# EAGLE design LED_Driver (EAGLE 8.0.0)
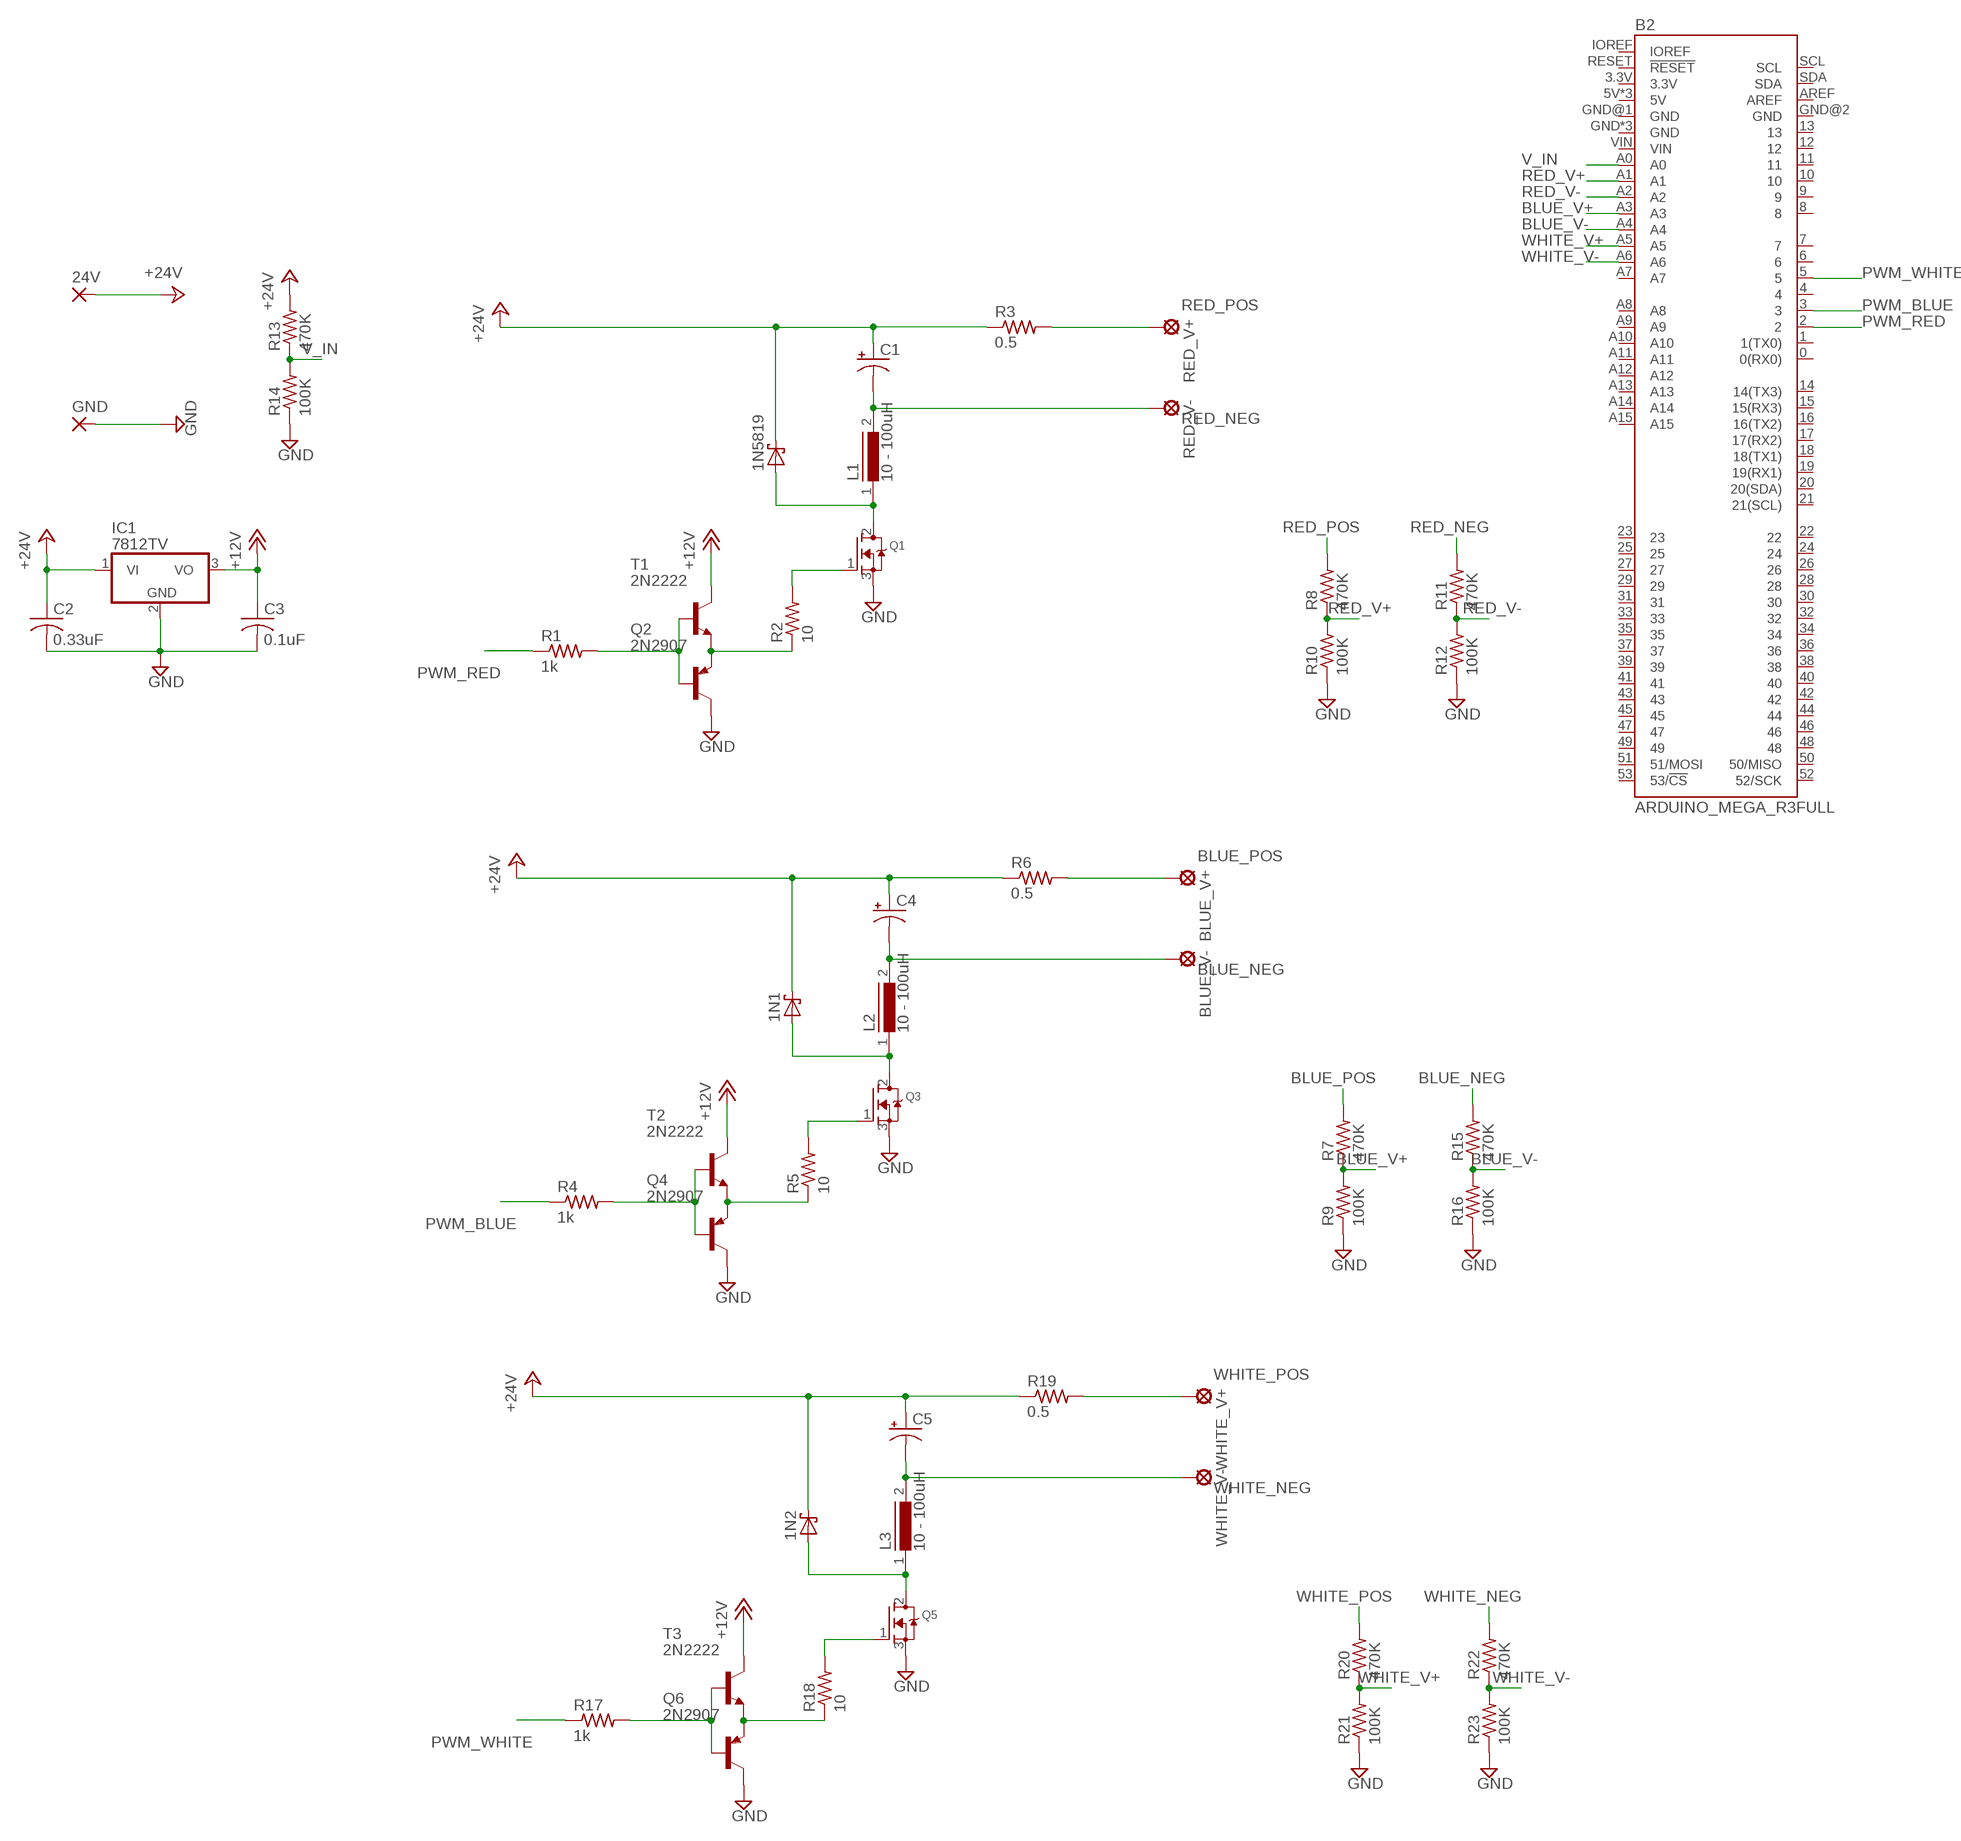
[diagram p0: schematic, sheet 1]

## Parts
1N1  SCHOTTKY-DIODEDO41  [DO41-10]
1N2  SCHOTTKY-DIODEDO41  [DO41-10]
1N5819  SCHOTTKY-DIODEDO41  [DO41-10]
24V  WIREPAD2,54/1,1  [2,54/1,1]
B2  ARDUINO_MEGA_R3FULL  [ARDUINO_MEGA_NO_SILK]
BLUE_V+  LSP13  [LSP13]
BLUE_V-  LSP13  [LSP13]
C1  CPOL-USE5-10.5  [E5-10,5]
C2  0.33uF  C-USC0805K  [C0805K]
C3  0.1uF  C-USC0805K  [C0805K]
C4  CPOL-USE5-10.5  [E5-10,5]
C5  CPOL-USE5-10.5  [E5-10,5]
GND  WIREPAD2,54/1,1  [2,54/1,1]
IC1  7812TV  [TO220V]
L1  10 - 100uH  SFT1030  [SFT1030]
L2  10 - 100uH  SFT1030  [SFT1030]
L3  10 - 100uH  SFT1030  [SFT1030]
Q1  MOSFET-NGDS_TO220V  [TO220V]
Q2  2N2907  [TO92-EBC-OVAL]
Q3  MOSFET-NGDS_TO220V  [TO220V]
Q4  2N2907  [TO92-EBC-OVAL]
Q5  MOSFET-NGDS_TO220V  [TO220V]
Q6  2N2907  [TO92-EBC-OVAL]
R1  1k  R-US_0207/7  [0207/7]
R2  10  R-US_0207/7  [0207/7]
R3  0.5  R-US_0207/7  [0207/7]
R4  1k  R-US_0207/7  [0207/7]
R5  10  R-US_0207/7  [0207/7]
R6  0.5  R-US_0207/7  [0207/7]
R7  470K  R-US_0207/7  [0207/7]
R8  470K  R-US_0207/7  [0207/7]
R9  100K  R-US_0207/7  [0207/7]
R10  100K  R-US_0207/7  [0207/7]
R11  470K  R-US_0207/7  [0207/7]
R12  100K  R-US_0207/7  [0207/7]
R13  470K  R-US_R0805  [R0805]
R14  100K  R-US_R0805  [R0805]
R15  470K  R-US_0207/7  [0207/7]
R16  100K  R-US_0207/7  [0207/7]
R17  1k  R-US_0207/7  [0207/7]
R18  10  R-US_0207/7  [0207/7]
R19  0.5  R-US_0207/7  [0207/7]
R20  470K  R-US_0207/7  [0207/7]
R21  100K  R-US_0207/7  [0207/7]
R22  470K  R-US_0207/7  [0207/7]
R23  100K  R-US_0207/7  [0207/7]
RED_V+  LSP13  [LSP13]
RED_V-  LSP13  [LSP13]
T1  2N2222  [TO92-EBC-OVAL]
T2  2N2222  [TO92-EBC-OVAL]
T3  2N2222  [TO92-EBC-OVAL]
WHITE_V+  LSP13  [LSP13]
WHITE_V-  LSP13  [LSP13]

## Nets
+12V: C3.1 IC1.3(VO) T1.C T2.C T3.C
+24V: 1N1.C 1N2.C 1N5819.C 24V.1(P) C1.+ C2.1 C4.+ C5.+ IC1.1(VI) R3.1 R6.1 R13.2 R19.1
BLUE_NEG: BLUE_V-.MP C4.- L2.2 R15.2
BLUE_POS: BLUE_V+.MP R6.2 R7.2
BLUE_V+: B2.A3 R7.1 R9.2
BLUE_V-: B2.A4 R15.1 R16.2
GND: C2.2 C3.2 GND.1(P) IC1.2(GND) Q1.3(S) Q2.C Q3.3(S) Q4.C Q5.3(S) Q6.C R9.1 R10.1 R12.1 R14.1 R16.1 R21.1 R23.1
N$1: Q2.E R2.1 T1.E
N$2: 1N5819.A L1.1 Q1.2(D)
N$3: Q4.E R5.1 T2.E
N$4: Q2.B R1.2 T1.B
N$5: Q1.1(G) R2.2
N$6: 1N1.A L2.1 Q3.2(D)
N$7: Q4.B R4.2 T2.B
N$8: Q3.1(G) R5.2
N$9: Q6.E R18.1 T3.E
N$10: 1N2.A L3.1 Q5.2(D)
N$11: Q6.B R17.2 T3.B
N$12: Q5.1(G) R18.2
PWM_BLUE: B2.3 R4.1
PWM_RED: B2.2 R1.1
PWM_WHITE: B2.5 R17.1
RED_NEG: C1.- L1.2 R11.2 RED_V-.MP
RED_POS: R3.2 R8.2 RED_V+.MP
RED_V+: B2.A1 R8.1 R10.2
RED_V-: B2.A2 R11.1 R12.2
V_IN: B2.A0 R13.1 R14.2
WHITE_NEG: C5.- L3.2 R22.2 WHITE_V-.MP
WHITE_POS: R19.2 R20.2 WHITE_V+.MP
WHITE_V+: B2.A5 R20.1 R21.2
WHITE_V-: B2.A6 R22.1 R23.2
Unconnected: B2.0(0(RX0)) B2.1(1(TX0)) B2.3.3V B2.4 B2.5V B2.5V@1(5V) B2.5V@2(5V) B2.6 B2.7 B2.8 B2.9 B2.10 B2.11 B2.12 B2.13 B2.14(14(TX3)) B2.15(15(RX3)) B2.16(16(TX2)) B2.17(17(RX2)) B2.18(18(TX1)) B2.19(19(RX1)) B2.20(20(SDA)) B2.21(21(SCL)) B2.22 B2.23 B2.24 B2.25 B2.26 B2.27 B2.28 B2.29 B2.30 B2.31 B2.32 B2.33 B2.34 B2.35 B2.36 B2.37 B2.38 B2.39 B2.40 B2.41 B2.42 B2.43 B2.44 B2.45 B2.46 B2.47 B2.48 B2.49 B2.50(50/MISO) B2.51(51/MOSI) B2.52(52/SCK) B2.53(53/!CS) B2.A7 B2.A8 B2.A9 B2.A10 B2.A11 B2.A12 B2.A13 B2.A14 B2.A15 B2.AREF B2.GND B2.GND@1(GND) B2.GND@2(GND) B2.GND@3(GND) B2.GND@4(GND) B2.IOREF B2.RESET(!RESET) B2.SCL B2.SDA B2.VIN

## Library data of the parts
1N1 1N2 1N5819 = adafruit:SCHOTTKY-DIODE: Schottky Diode
24V GND = wirepad:WIREPAD: Wire PAD connect wire on PCB
B2 = Sparkfun-Boards:ARDUINO_MEGA_R3: Arduino Mega R3 ATmega2560 R3 compatible footprint. SparkFun Products: Arduino Mega 2560 R3 <�https://www.sparkfun.com/products/11061�>
BLUE_V+ BLUE_V- RED_V+ RED_V- WHITE_V+ WHITE_V- = solpad:LSP13: SOLDER PAD drill 1.3 mm, distributor Buerklin, 12H562
C1 C4 C5 = adafruit:CPOL-US: POLARIZED CAPACITOR, American symbol
C2 C3 = adafruit:C-US: CAPACITOR, American symbol
IC1 = linear:78*: Positive VOLTAGE REGULATOR Source: http://cache.national.com/ds/LM/LM78L05.pdf http://www.fairchildsemi.com/ds/LM/LM7805.pdf
L1-L3 = inductors:SFT1030: INDUCTOR
Q1 Q3 Q5 = adafruit:MOSFET-N: N-Channel Mosfet 2N7002E - 60V 260mA SOT23 [Digikey: 2N7002ET1GOSTR-ND] - REEL BSH103 - 30V 850mA SOT23 [Digikey: 568-5013-1-ND]
Q2 Q4 Q6 = adafruit:2N2907*: PNP Transistor Big Oval pads
R1-R23 = adafruit:R-US_: RESISTOR, American symbol
T1-T3 = adafruit:2N2222: NPN TRANSISTOR Big oval pads

## Board
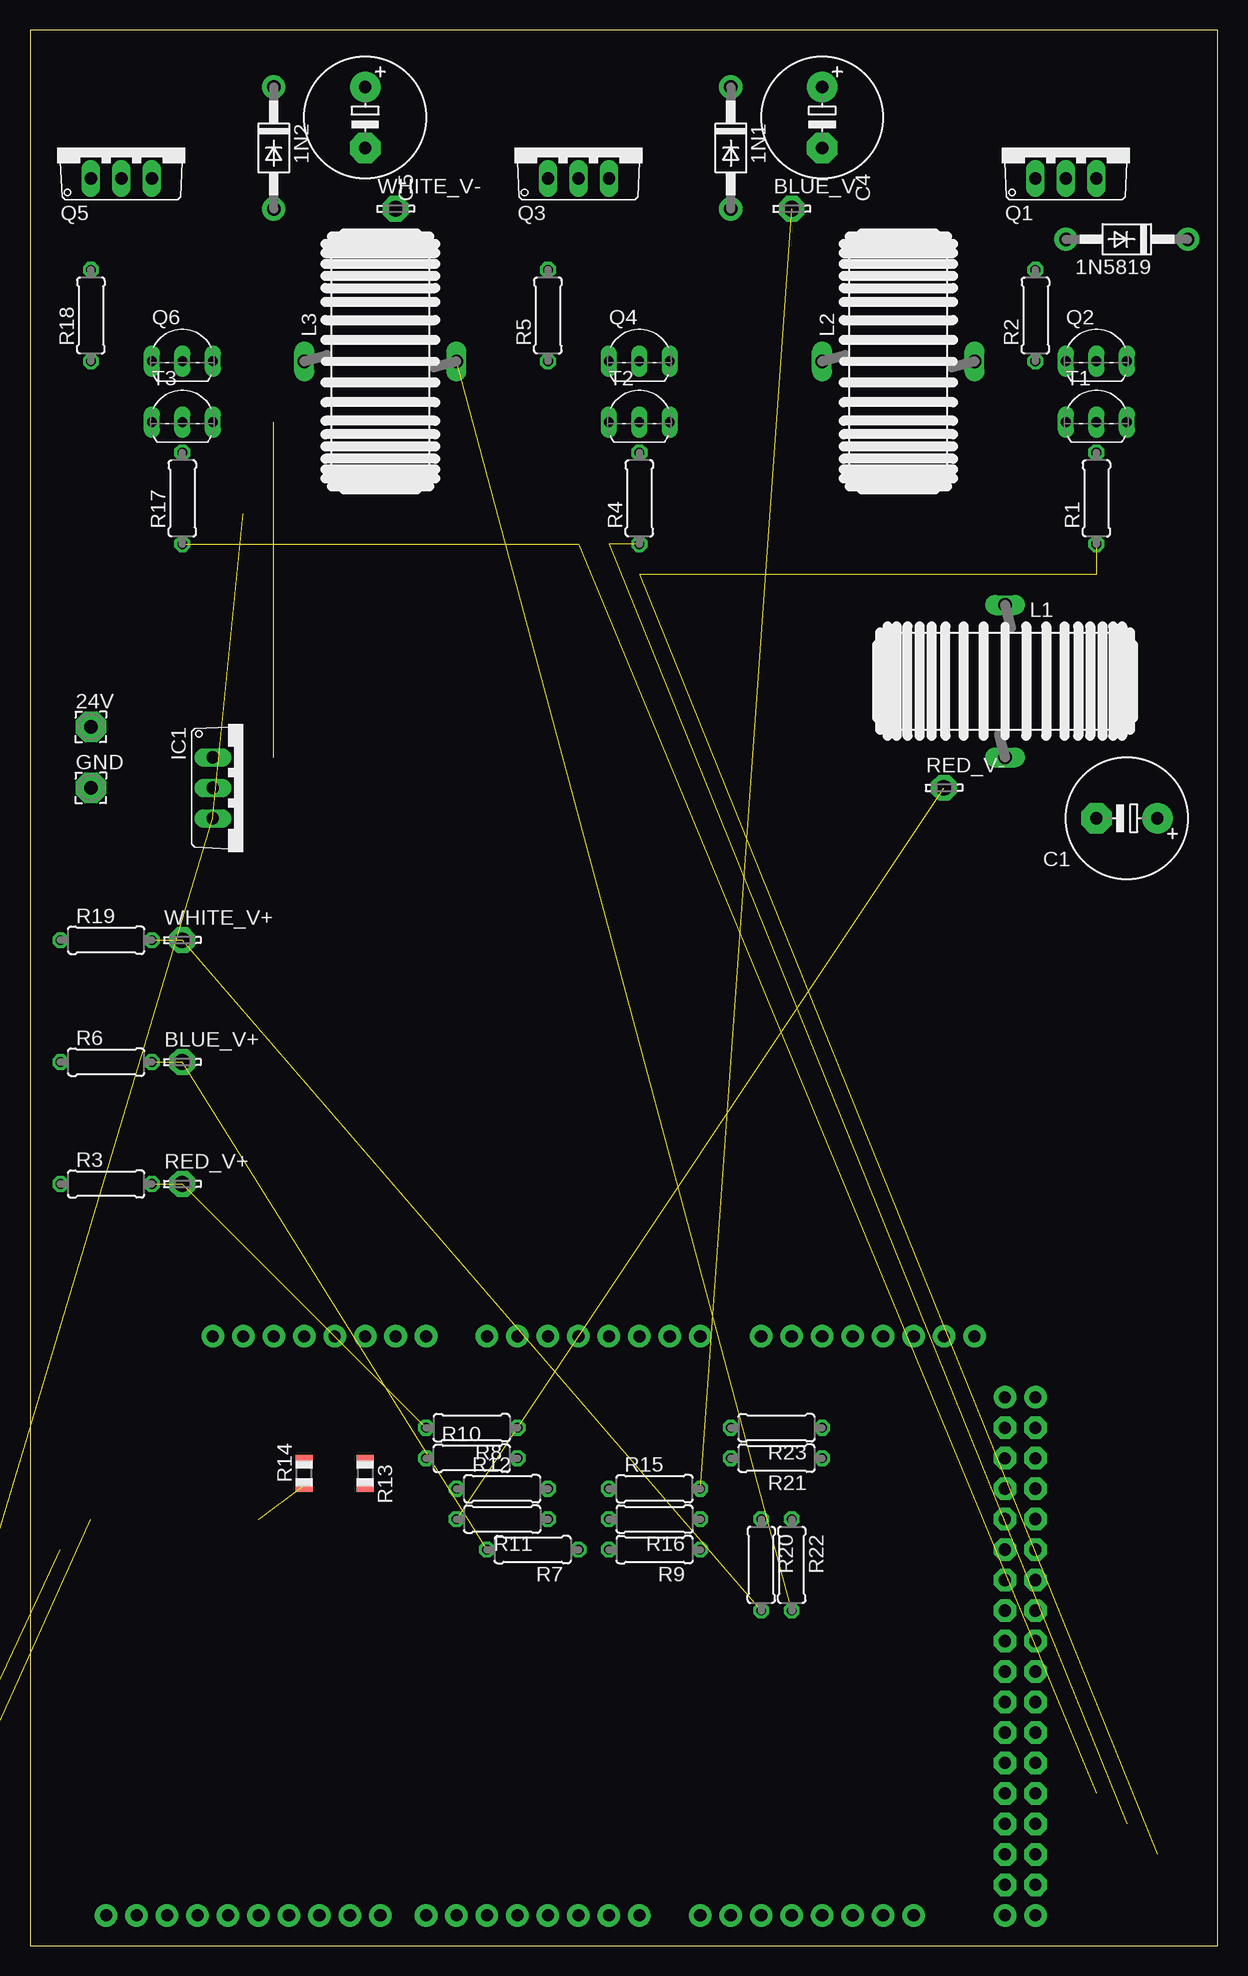
[diagram p1: board, top side]
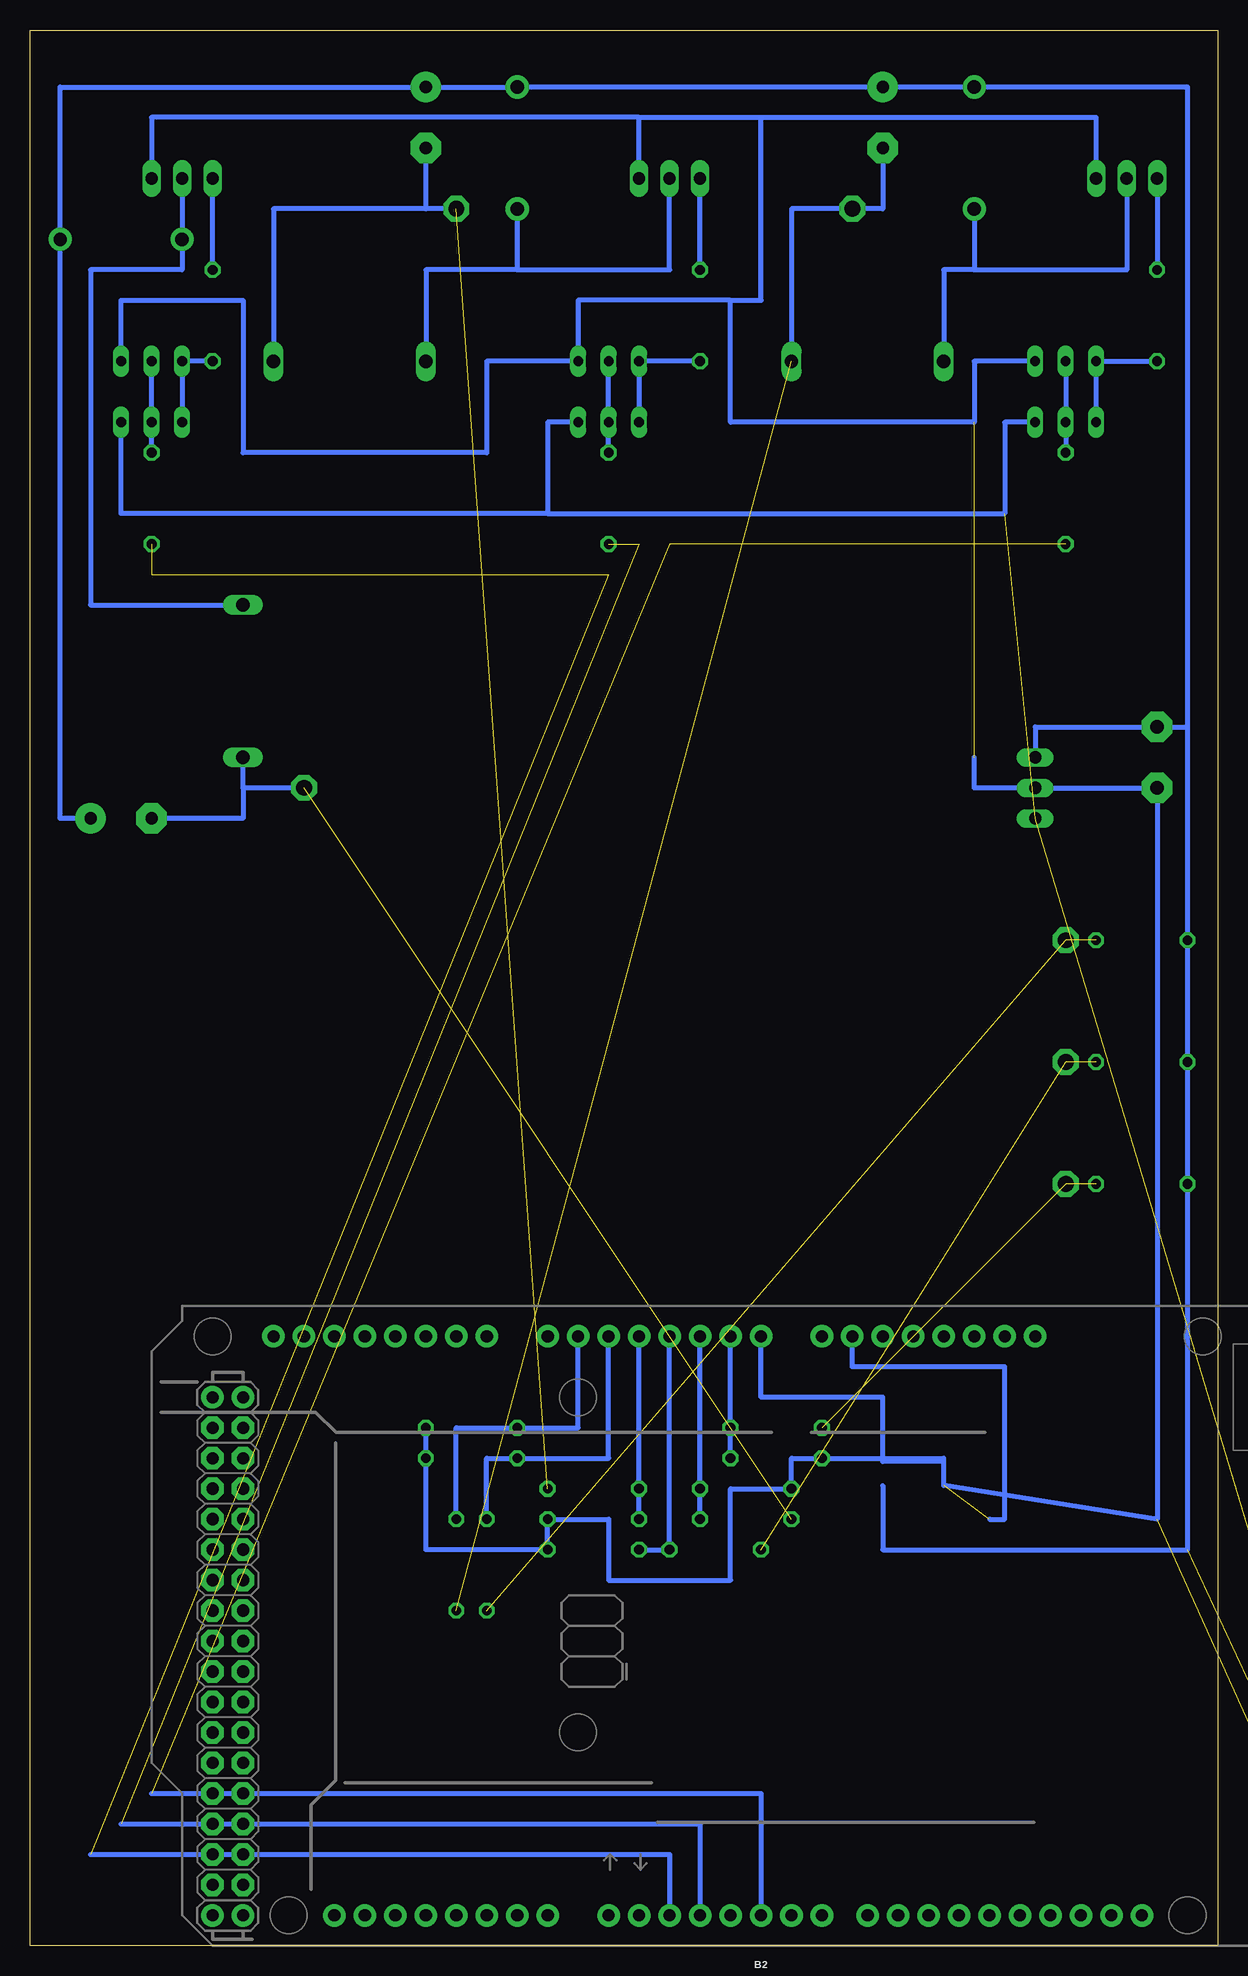
[diagram p2: board, bottom side, seen from below]

Size 99.04 x 159.69 mm. Coordinates in mm from the lower left corner, seen from the top.
Outline: 0,0 99.04,0 99.04,159.69 0,159.69 0,0
Copper layers (1*16): Top 0.035mm / dielectric 1.5mm / Bottom 0.035mm
Design rules "default": minimum track width 10mil, minimum drill 24mil, track to track 8mil, track to pad 8mil, pad to pad 8mil, via to via 8mil, smd to smd 8mil, copper to edge 40mil, drill to drill 8mil, minimum pad ring 10mil, minimum via ring 8mil, stop-mask expansion 4mil, vias tented up to drill 0mil, thermal gap 10mil

### Footprints (pad centres in the part's own frame; a part is rotated, then mirrored left to right if it is on the bottom)
DO41-10 = drill 1.118 pad 1.93: A 5.08,0; C -5.08,0
2,54/1,1 = drill 1.118 pad 2.54 octagon: 1 0,0
ARDUINO_MEGA_NO_SILK = drill 1.016 pad 1.88: 0 13.97,24.13; 1 11.43,24.13; 2 8.89,24.13; 3 6.35,24.13; 3.3V -13.97,-24.13; 4 3.81,24.13; 5 1.27,24.13; 5V -11.43,-24.13; 5V@1 44.45,24.13; 5V@2 46.99,24.13; 6 -1.27,24.13; 7 -3.81,24.13; 8 -7.62,24.13; 9 -10.16,24.13; 10 -12.7,24.13; 11 -15.24,24.13; 12 -17.78,24.13; 13 -20.32,24.13; 14 19.05,24.13; 15 21.59,24.13; 16 24.13,24.13; 17 26.67,24.13; 18 29.21,24.13; 19 31.75,24.13; 20 34.29,24.13; 21 36.83,24.13; A0 1.27,-24.13; A1 3.81,-24.13; A2 6.35,-24.13; A3 8.89,-24.13; A4 11.43,-24.13; A5 13.97,-24.13; A6 16.51,-24.13; A7 19.05,-24.13; A8 24.13,-24.13; A9 26.67,-24.13; A10 29.21,-24.13; A11 31.75,-24.13; A12 34.29,-24.13; A13 36.83,-24.13; A14 39.37,-24.13; A15 41.91,-24.13; AREF -25.4,24.13; GND -8.89,-24.13; GND@1 -6.35,-24.13; GND@2 44.45,-19.05; GND@3 46.99,-19.05; GND@4 -22.86,24.13; IOREF -19.05,-24.13; NC -21.59,-24.13; RESET -16.51,-24.13; SCL -30.48,24.13; SDA -27.94,24.13; VIN -3.81,-24.13 | drill 1.016 pad 1.88 octagon: 22 44.45,21.59; 23 46.99,21.59; 24 44.45,19.05; 25 46.99,19.05; 26 44.45,16.51; 27 46.99,16.51; 28 44.45,13.97; 29 46.99,13.97; 30 44.45,11.43; 31 46.99,11.43; 32 44.45,8.89; 33 46.99,8.89; 34 44.45,6.35; 35 46.99,6.35; 36 44.45,3.81; 37 46.99,3.81; 38 44.45,1.27; 39 46.99,1.27; 40 44.45,-1.27; 41 46.99,-1.27; 42 44.45,-3.81; 43 46.99,-3.81; 44 44.45,-6.35; 45 46.99,-6.35; 46 44.45,-8.89; 47 46.99,-8.89; 48 44.45,-11.43; 49 46.99,-11.43; 50 44.45,-13.97; 51 46.99,-13.97; 52 44.45,-16.51; 53 46.99,-16.51
LSP13 = drill 1.321 pad 2.159 octagon: MP 0,0
E5-10,5 = drill 1.016 pad 2.54: + -2.54,0 | drill 1.016 pad 2.54 octagon: - 2.54,0
C0805K = smd 1.1 x 1.4: 1 -1,0; 2 1,0
TO220V = drill 1.016 long: 1 -2.54,-2.54; 2 0,-2.54; 3 2.54,-2.54
SFT1030 = drill 1.118 long: 1 -6.35,0; 2 6.35,0
TO92-EBC-OVAL = drill 0.813 long: B 0,-1.27; C 2.54,-1.27; E -2.54,-1.27
0207/7 = drill 0.813 octagon: 1 -3.81,0; 2 3.81,0
R0805 = smd 1.1 x 1.4: 1 -1,0; 2 1,0

### Placement (x,y rotation side)
1N1  58.42,149.86 270 top
1N2  20.32,149.86 270 top
1N5819  91.44,142.24 180 top
24V  5.08,101.6 0 top
B2  36.83,26.67 180 bottom
BLUE_V+  12.7,73.66 0 top
BLUE_V-  63.5,144.78 0 top
C1  91.44,93.98 180 top
C2  -16.51,-10.16 0 top  (outside the outline)
C3  -16.51,-15.24 0 top  (outside the outline)
C4  66.04,152.4 270 top
C5  27.94,152.4 270 top
GND  5.08,96.52 0 top
IC1  17.78,96.52 270 top
L1  81.28,105.41 270 top
L2  72.39,132.08 0 top
L3  29.21,132.08 0 top
Q1  86.36,149.86 0 top
Q2  88.9,133.35 0 top
Q3  45.72,149.86 0 top
Q4  50.8,133.35 0 top
Q5  7.62,149.86 0 top
Q6  12.7,133.35 0 top
R1  88.9,120.65 90 top
R2  83.82,135.89 90 top
R3  6.35,63.5 0 top
R4  50.8,120.65 90 top
R5  43.18,135.89 90 top
R6  6.35,73.66 0 top
R7  41.91,33.02 180 top
R8  36.83,43.18 180 top
R9  52.07,33.02 180 top
R10  36.83,40.64 0 top
R11  39.37,35.56 180 top
R12  39.37,38.1 0 top
R13  27.94,39.37 270 top
R14  22.86,39.37 90 top
R15  52.07,38.1 0 top
R16  52.07,35.56 180 top
R17  12.7,120.65 90 top
R18  5.08,135.89 90 top
R19  6.35,83.82 0 top
R20  60.96,31.75 270 top
R21  62.23,40.64 180 top
R22  63.5,31.75 270 top
R23  62.23,43.18 180 top
RED_V+  12.7,63.5 0 top
RED_V-  76.2,96.52 0 top
T1  88.9,128.27 0 top
T2  50.8,128.27 0 top
T3  12.7,128.27 0 top
WHITE_V+  12.7,83.82 0 top
WHITE_V-  30.48,144.78 0 top

### Tracks (layer width: path | path; a pad name or v marks a point on that pad's centre or on a via)
+12V  (2 unrouted)
  Bottom 0.406: T1.C 91.44,119.38 55.88,119.38 | 55.88,119.38 17.78,119.38 17.78,127 T3.C | T2.C 55.88,127 55.88,119.38
+24V  (1 unrouted)
  Bottom 0.406: IC1.1 15.24,101.6 24V.1 2.54,101.6 | R13.2 27.94,33.02 2.54,33.02 R3.1 R6.1 R19.1 2.54,101.6 | C1.+ 96.52,93.98 1N5819.C 96.52,154.94 C4.+ 1N1.C C5.+ 1N2.C 2.54,154.94 2.54,101.6
BLUE_NEG  (1 unrouted)
  Bottom 0.406: 66.04,144.78 C4.- | 66.04,144.78 78.74,144.78 L2.2 | BLUE_V-.MP 66.04,144.78
BLUE_POS  (2 unrouted)
BLUE_V+
  Bottom 0.406: B2.A3 R7.1 R9.2
BLUE_V-
  Bottom 0.406: B2.A4 R15.1 R16.2
GND  (4 unrouted)
  Bottom 0.406: Q2.C 91.44,137.16 81.28,137.16 81.28,124.46 60.96,124.46 60.96,132.08 Q4.C 53.34,137.16 40.64,137.16 | 20.32,99.06 20.32,96.52 IC1.2 GND.1 5.08,35.56 R14.1 22.86,40.64 R10.1 35.56,40.64 R12.1 40.64,38.1 40.64,30.48 50.8,30.48 50.8,35.56 R16.1 R9.1 66.04,33.02 R21.1 R23.1 | 40.64,137.16 38.1,137.16 38.1,152.4 | 38.1,152.4 10.16,152.4 Q5.3 | 48.26,152.4 38.1,152.4 | 48.26,152.4 88.9,152.4 Q1.3 | Q3.3 48.26,152.4 | Q6.C 20.32,132.08 20.32,127 40.64,127 40.64,137.16 | 19.05,35.56 17.78,35.56 17.78,48.26 30.48,48.26 30.48,50.8
N$1
  Bottom 0.406: T1.E Q2.E R2.1
N$2
  Bottom 0.406: Q1.2 1N5819.A 86.36,139.7 93.98,139.7 93.98,111.76 L1.1
N$3
  Bottom 0.406: T2.E Q4.E R5.1
N$4
  Bottom 0.406: R1.2 T1.B Q2.B
N$5
  Bottom 0.406: R2.2 Q1.1
N$6
  Bottom 0.406: Q3.2 45.72,139.7 58.42,139.7 | 1N1.A 58.42,139.7 | 58.42,139.7 66.04,139.7 L2.1
N$7
  Bottom 0.406: R4.2 T2.B Q4.B
N$8
  Bottom 0.406: R5.2 Q3.1
N$9
  Bottom 0.406: T3.E Q6.E R18.1
N$10
  Bottom 0.406: L3.1 22.86,139.7 20.32,139.7 | Q5.2 7.62,139.7 20.32,139.7 | 1N2.A 20.32,139.7
N$11
  Bottom 0.406: Q6.B T3.B R17.2
N$12
  Bottom 0.406: Q5.1 R18.2
PWM_BLUE  (2 unrouted)
  Bottom 0.406: 91.44,10.16 43.18,10.16 B2.3
PWM_RED  (3 unrouted)
  Bottom 0.406: 93.98,7.62 45.72,7.62 B2.2
PWM_WHITE  (2 unrouted)
  Bottom 0.406: 88.9,12.7 38.1,12.7 B2.5
RED_NEG  (1 unrouted)
  Bottom 0.406: 81.28,96.52 L1.2 | 81.28,96.52 81.28,93.98 C1.- | RED_V-.MP 81.28,96.52
RED_POS  (2 unrouted)
RED_V+
  Bottom 0.406: R10.2 R8.1 B2.A1
RED_V-
  Bottom 0.406: R11.1 R12.2 B2.A2
V_IN
  Bottom 0.406: R14.2 R13.1 27.94,45.72 38.1,45.72 B2.A0
WHITE_NEG  (1 unrouted)
  Bottom 0.406: C5.- 27.94,144.78 WHITE_V-.MP 35.56,144.78 L3.2
WHITE_POS  (2 unrouted)
WHITE_V+
  Bottom 0.406: B2.A5 50.8,40.64 R21.2 60.96,40.64 R20.1
WHITE_V-
  Bottom 0.406: B2.A6 53.34,43.18 R23.2 63.5,43.18 R22.1